# Altium schematic sheet UPCNSL_ABS_RF_POL.SchDoc
size A4
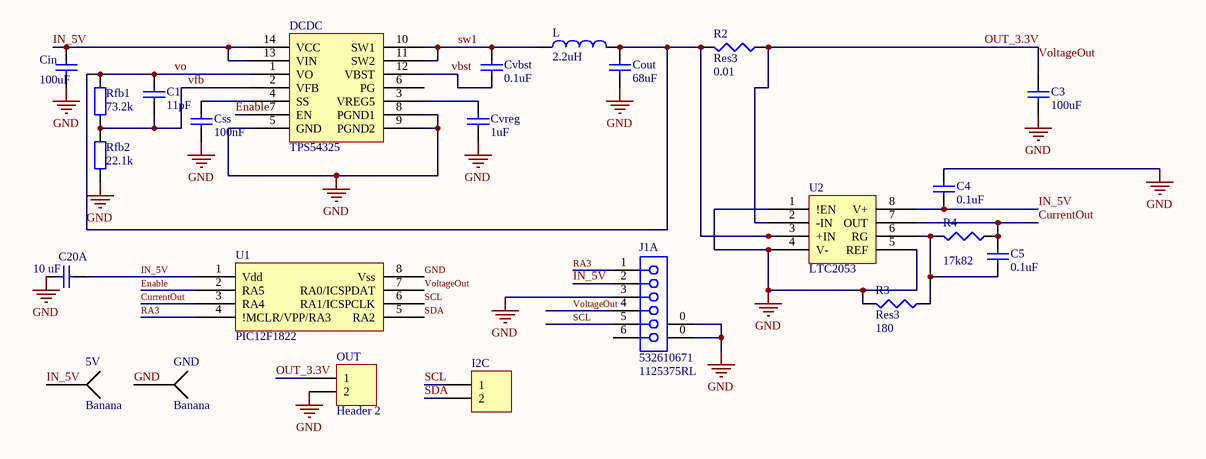
[diagram p0: UPCNSL_ABS_RF_POL.SchDoc]

## Parts
5V  Banana  [Banana]
C1  value 11pF  [CAP0603]  (hidden comment: CAP0603)
C3  value 100uF  [CAP0603]  (hidden comment: CAP0603)
C4  value 0.1uF  [CAP0603]  (hidden comment: CAP0603)
C5  value 0.1uF  [CAP0603]  (hidden comment: CAP0603)
C20A  value 10 uF  [CAP0603]  (hidden comment: Cap Semi)
Cin  value 100uF  [CAP0603]  (hidden comment: CAP0603)
Cout  value 68uF  [CAP0603]  (hidden comment: CAP0603)
Css  value 100nF  [CAP0603]  (hidden comment: CAP0603)
Cvbst  value 0.1uF  [CAP0603]  (hidden comment: CAP0603)
Cvreg  value 1uF  [CAP0603]  (hidden comment: CAP0603)
DCDC  TPS54325  [TPS54325]
GND  Banana  [Banana]
I2C  Header 2  [HDR1X2]  (value not drawn)
J1A  532610671  Supplier Part Number 1: 1125375RL  [532610671]
L  2.2uH  [L_DCDC_TPS54325_v2]
OUT  Header 2  [HDR1X2]
R2  Res3  value 0.01  [J1-0603]
R3  Res3  value 180  [J1-0603]
R4  value 17k82  [J1-0603]  (hidden comment: Res3)
Rfb1  value 73.2k  [RES0603]  (hidden comment: RES0603)
Rfb2  value 22.1k  [RES0603]  (hidden comment: RES0603)
U1  PIC12F1822  [PIC12F1822]
U2  LTC2053  [LTC2053 IPC]

## Nets
GND: C3.2 C4.1 C20A.2 Cin.1 Cout.1 Css.1 Cvreg.1 DCDC.5(GND) DCDC.8(PGND1) DCDC.9(PGND2) GND.1 J1A.0(MH1) J1A.3 OUT.2 R3.2 Rfb2.1 U1.8(Vss) U2.1(!EN) U2.4(V-) U2.5(REF)
CurrentOut: C5.1 R4.1 U1.3(RA4) U2.7(OUT)
Enable: DCDC.7(EN) U1.2(RA5)
IN_5V: 5V.1 C4.2 C20A.1 Cin.2 DCDC.13(VIN) DCDC.14(VCC) J1A.2 U1.1(Vdd) U2.8(V+)
OUT_3.3V: C3.1 J1A.4 OUT.1 R2.1 U1.7(RA0/ICSPDAT) U2.2(-IN)  [also labelled VoltageOut]
RA3: J1A.1 U1.4(!MCLR/VPP/RA3)
SCL: I2C.1 J1A.5 U1.6(RA1/ICSPCLK)
SDA: I2C.2 U1.5(RA2)
sw1: Cvbst.2 DCDC.10(SW1) DCDC.11(SW2) L.1
vbst: Cvbst.1 DCDC.12(VBST)
vfb: C1.1 DCDC.2(VFB) Rfb1.1 Rfb2.2
vo: C1.2 Cout.2 DCDC.1(VO) L.2 R2.2 Rfb1.2 U2.3(+IN)
NetC5_2: C5.2 R3.1 R4.2 U2.6(RG)
NetCss_2: Css.2 DCDC.4(SS)
NetCvreg_2: Cvreg.2 DCDC.3(VREG5)

Not connected (* = marked no-connect by the designer): DCDC 6(PG); J1A 6

## Library data of the parts
C1 C3-C5 Cin Cout Css Cvbst Cvreg = CAP0603: Capacitor
C20A = Cap Semi: Capacitor (Semiconductor SIM Model); Published: 8-Jun-2000; LatestRevisionDate: 29-May-2009; LatestRevisionNote: IPC-7351 Footprint Added.; PackageReference: C1206; Publisher: Altium Limited; PackageDescription: Chip Capacitor
I2C OUT = Header 2: Header, 2-Pin; LatestRevisionDate: 17-Jul-2002; LatestRevisionNote: Re-released for DXP Platform.; Publisher: Altium Limited
J1A = MOLEX_532610671: 1.25mm Pitch PicoBlade™ Header, Surface Mount, Right Angle, Lead-Free, 6 Circuits; Supplier 1: Farnell
L = L_DCDC_TPS54325
R2-R4 = Res3: Resistor; Published: 8-Jun-2000; LatestRevisionDate: 29-May-2009; LatestRevisionNote: IPC-7351 Footprint Added.; PackageReference: J1-0603; Publisher: Altium Limited; PackageDescription: Chip Resistor
Rfb1 Rfb2 = RES0603: Resistor